# EAGLE design AntiSpark_Switch (EAGLE 8.0.0)
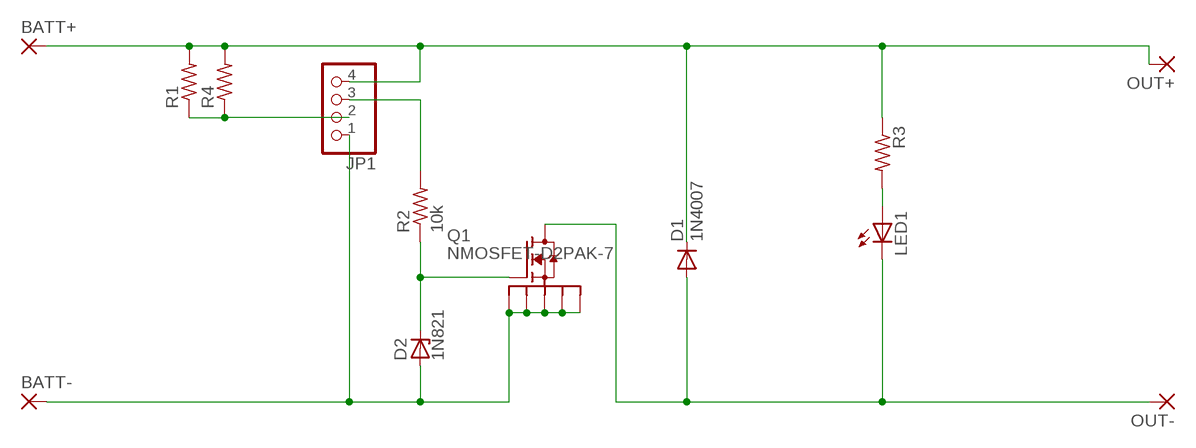
[diagram p0: schematic, sheet 1]

## Parts
BATT+  WIREPAD4,16O1,6  [4,16O1,6]
BATT-  WIREPAD4,16O1,6  [4,16O1,6]
D1  1N4007  1N4004  [DO41-10]
D2  1N821  [DO35Z10]
JP1  PINHD-1X4  [1X04]
LED1  LED5MM  [LED5MM]
OUT+  WIREPAD4,16O1,6  [4,16O1,6]
OUT-  WIREPAD4,16O1,6  [4,16O1,6]
Q1  NMOSFET-D2PAK-7  [D2PAK-7]
R1  R-US_0207/7  [0207/7]
R2  10k  R-US_0207/7  [0207/7]
R3  R-US_0207/7  [0207/7]
R4  R-US_0207/7  [0207/7]

## Nets
N$1 [Power]: BATT-.1(P) D2.A JP1.1 Q1.S1 Q1.S2 Q1.S3 Q1.S4 Q1.S5
N$2: D2.C Q1.G R2.1
N$3: JP1.3 R2.2
N$4 [Power]: BATT+.1(P) D1.C JP1.4 OUT+.1(P) R1.2 R3.1 R4.2
N$5 [Power]: D1.A LED1.K(C) OUT-.1(P) Q1.D
N$6: JP1.2 R1.1 R4.1
N$7: LED1.A R3.2

## Library data of the parts
BATT+ BATT- OUT+ OUT- = wirepad:WIREPAD: Wire PAD connect wire on PCB
D1 = adafruit:1N4004: DIODE General purpose 1N400x type rectifier (With bigger pads) http://www.ladyada.net/library/pcb/eaglelibrary.html
D2 = diode:1N821: Reference DIODE temperature compensated, 6,2 V
JP1 = pinhead:PINHD-1X4: PIN HEADER
LED1 = led:LED: LED OSRAM: - CHIPLED LG R971, LG N971, LY N971, LG Q971, LY Q971, LO R971, LY R971 LH N974, LH R974 LS Q976, LO Q976, LY Q976 LO Q996 - Hyper CHIPLED LW Q18S LB Q993, LB Q99A, LB R99A - SideLED LS A670, LO A670, LY A670, LG A670, LP A670 LB A673, LV A673, LT A673, LW A673 LH A674 LY A675 LS A676, LA A676, LO A676, LY A676, LW A676 LS A679, LY A679, LG A679 - Hyper Micro SIDELED® LS Y876, LA Y876, LO Y876, LY Y876 LT Y87S - SmartLED LW L88C, LW L88S LB L89C, LB L89S, LG L890 LS L89K, LO L89K, LY L89K LS L896, LA L896, LO L896, LY L896 - TOPLED LS T670, LO T670, LY T670, LG T670, LP T670 LSG T670, LSP T670, LSY T670, LOP T670, LYG T670 LG T671, LOG T671, LSG T671 LB T673, LV T673, LT T673, LW T673 LH T674 LS T676, LA T676, LO T676, LY T676, LB T676, LH T676, LSB T676, LW T676 LB T67C, LV T67C, LT T67C, LS T67K, LO T67K, LY T67K, LW E67C LS E67B, LA E67B, LO E67B, LY E67B, LB E67C, LV E67C, LT E67C LW T67C LS T679, LY T679, LG T679 LS T770, LO T770, LY T770, LG T770, LP T770 LB T773, LV T773, LT T773, LW T773 LH T774 LS E675, LA E675, LY E675, LS T675 LS T776, LA T776, LO T776, LY T776, LB T776 LHGB T686 LT T68C, LB T68C - Hyper Mini TOPLED® LB M676 - Mini TOPLED Santana® LG M470 LS M47K, LO M47K, LY M47K Source: http://www.osram.convergy.de LUXEON: - LUMILED® LXK2-PW12-R00, LXK2-PW12-S00, LXK2-PW14-U00, LXK2-PW14-V00 LXK2-PM12-R00, LXK2-PM12-S00, LXK2-PM14-U00 LXK2-PE12-Q00, LXK2-PE12-R00, LXK2-PE12-S00, LXK2-PE14-T00, LXK2-PE14-U00 LXK2-PB12-K00, LXK2-PB12-L00, LXK2-PB12-M00, LXK2-PB14-N00, LXK2-PB14-P00, LXK2-PB14-Q00 LXK2-PR12-L00, LXK2-PR12-M00, LXK2-PR14-Q00, LXK2-PR14-R00 LXK2-PD12-Q00, LXK2-PD12-R00, LXK2-PD12-S00 LXK2-PH12-R00, LXK2-PH12-S00 LXK2-PL12-P00, LXK2-PL12-Q00, LXK2-PL12-R00 Source: www.luxeon.com KINGBRIGHT: KA-3528ASYC Source: www.kingbright.com
Q1 = D2PAK 7-P:NMOSFET-D2PAK-7
R1-R4 = resistor:R-US_: RESISTOR, American symbol

## Net classes
0 default: width 0.635 mm
1 Power: width 2.54 mm

## Board
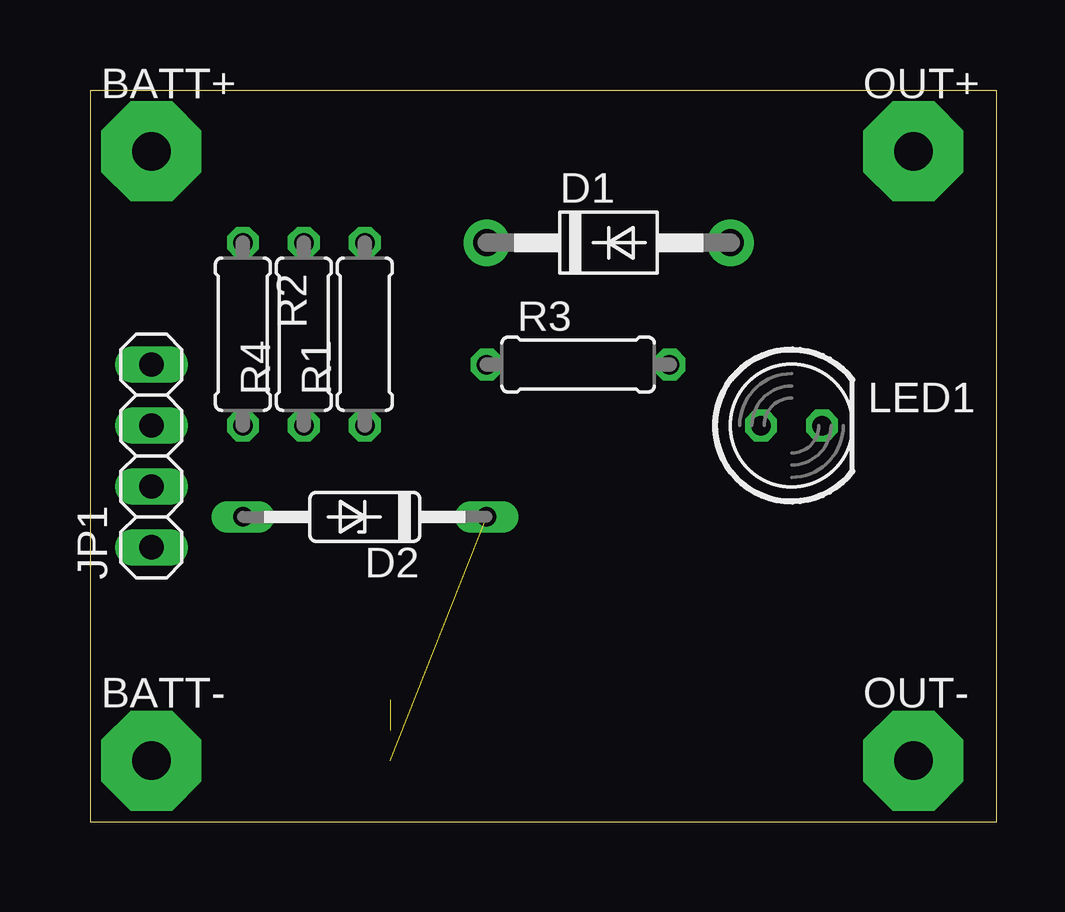
[diagram p1: board, top side]
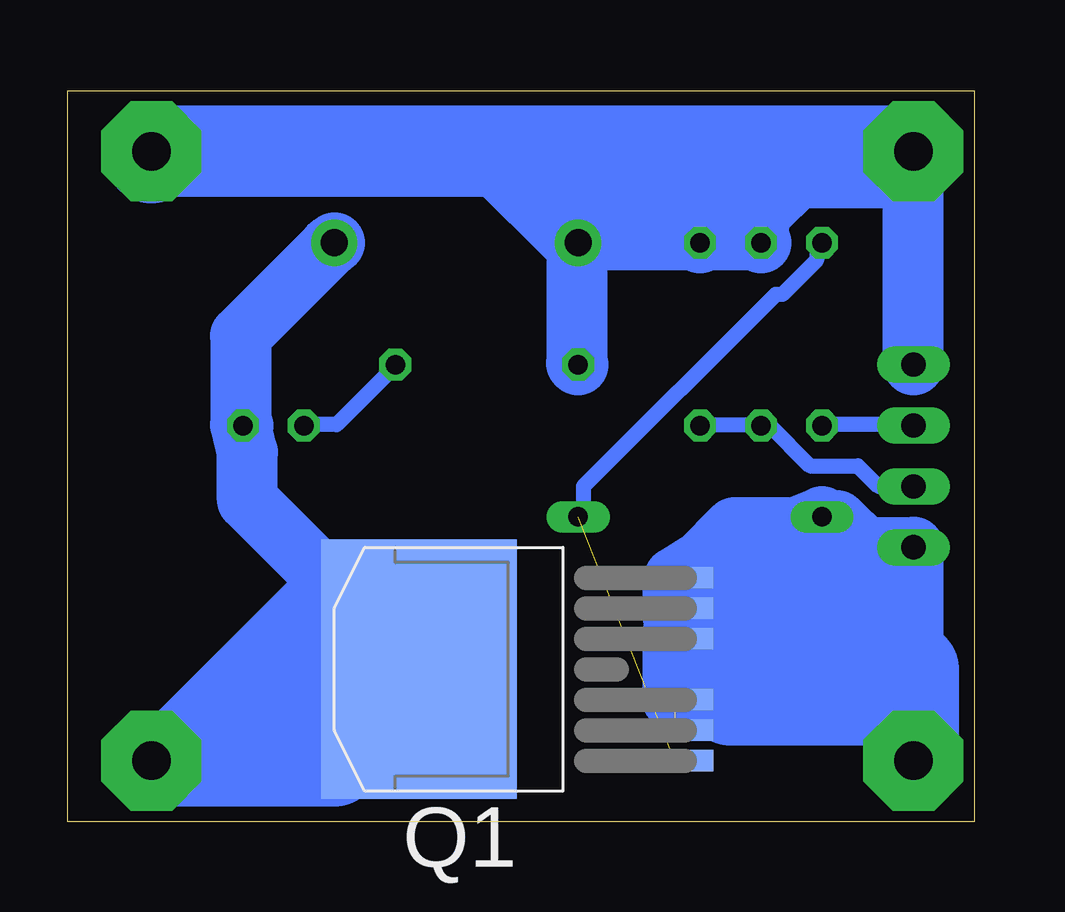
[diagram p2: board, bottom side, seen from below]

Size 37.77 x 30.47 mm. Coordinates in mm from the lower left corner, seen from the top.
Outline: 0,0 37.77,0 37.77,30.47 0,30.47 0,0
Copper layers (1*16): Top 0.035mm / dielectric 1.5mm / Bottom 0.035mm
Design rules "default *": minimum track width 10mil, minimum drill 24mil, track to track 20mil, track to pad 20mil, pad to pad 20mil, via to via 8mil, smd to smd 20mil, copper to edge 40mil, drill to drill 8mil, minimum pad ring 10mil, minimum via ring 8mil, stop-mask expansion 4mil, vias tented up to drill 0mil, thermal gap 10mil

### Footprints (pad centres in the part's own frame; a part is rotated, then mirrored left to right if it is on the bottom)
4,16O1,6 = drill 1.6 pad 4.166 octagon: 1 0,0
DO41-10 = drill 1.118 pad 1.93: A 5.08,0; C -5.08,0
DO35Z10 = drill 0.813 long: A 5.08,0; C -5.08,0
1X04 = drill 1.016 long: 1 -3.81,0; 2 -1.27,0; 3 1.27,0; 4 3.81,0
LED5MM = drill 0.813 octagon: A -1.27,0; K 1.27,0
D2PAK-7 = smd 10.8 x 8.15: D 0,4.1 | smd 0.9 x 3.2: G -3.81,-6.56; S1 -2.54,-6.56; S2 -1.27,-6.56; S3 1.27,-6.56; S4 2.54,-6.56; S5 3.81,-6.56
0207/7 = drill 0.813 octagon: 1 -3.81,0; 2 3.81,0

### Placement (x,y rotation side)
BATT+  2.54,27.94 0 top
BATT-  2.54,2.54 0 top
D1  21.59,24.13 0 top
D2  11.43,12.7 180 top
JP1  2.54,15.24 90 top
LED1  29.21,16.51 0 top
OUT+  34.29,27.94 0 top
OUT-  34.29,2.54 0 top
Q1  19.05,6.35 90 bottom
R1  11.43,20.32 90 top
R2  6.35,20.32 270 top
R3  20.32,19.05 0 top
R4  8.89,20.32 90 top

### Tracks (layer width: path | path; a pad name or v marks a point on that pad's centre or on a via)
N$1  (1 unrouted)
  Bottom 2.54: 2.57,11.4 4.57,11.4 5.71,12.54 6.29,12.54 D2.A 7.43,12.26 10,12.26 11.43,10.83 Q1.S5 12.57,9.97 12.57,8.83 | 2.57,11.4 JP1.1 | Q1.S2 12.57,5.11 12.57,7.4 Q1.S3 12.57,8.83 | 12.57,8.83 Q1.S4 | 2.57,11.4 2.57,2.54 BATT-.1
  Bottom 3.81: BATT-.1 2.54,6.35 5.08,8.89 6.35,8.89 | 6.35,8.89 7.62,10.16 10.16,10.16 10.16,8.89 11.43,7.62 11.43,6.35 3.81,6.35 3.81,5.08 10.16,5.08 6.35,8.89
N$2  (1 unrouted)
  Bottom 0.635: D2.C 16.29,12.83 16.29,13.97 8.29,21.97 8,21.97 6.57,23.4 6.57,23.97 R2.1
N$3
  Bottom 0.635: R2.2 6.29,16.54 2.57,16.54 JP1.3
N$4
  Bottom 2.54: 11.43,24.26 9.14,24.26 | 9.14,24.26 R4.2 | 11.43,24.26 R1.2 | 16.57,23.97 16.57,19.11 R3.1 | 16.57,23.97 D1.C | 11.43,24.26 15.43,24.26 16.57,23.97 | JP1.4 2.57,19.11 2.57,27.69 BATT+.1 3.71,26.83 7.43,26.83 8.86,25.4 9.14,24.26 | 16.57,23.97 20.29,27.69 34.29,27.69 OUT+.1
  Bottom 3.81: 34.29,27.69 34.04,27.94 BATT+.1 10.16,27.94 11.43,26.67 16.51,26.67
N$5
  Bottom 2.54: 30.57,16.54 30.57,20.26 26.86,23.97 D1.A | 30.57,16.54 LED1.K | 26.86,9.97 23.43,6.54 Q1.D | 26.86,9.97 30.29,13.4 30.29,15.4 30.57,16.54 | 26.86,9.97 OUT-.1
  Bottom 3.81: OUT-.1 33.02,2.54 | 33.02,2.54 26.67,2.54 26.67,7.62 30.48,3.81 31.75,3.81 33.02,2.54
N$6
  Bottom 0.635: R1.1 11.43,16.54 9.14,16.54 R4.1 8.57,16.54 6.86,14.83 4.86,14.83 4,13.97 JP1.2
N$7
  Bottom 0.635: LED1.A 27.72,16.54 26.57,16.54 24.29,18.83 R3.2